# Altium schematic sheet Pasa_altas.SchDoc
size A; SheetNumber: 2; SheetTotal: 4
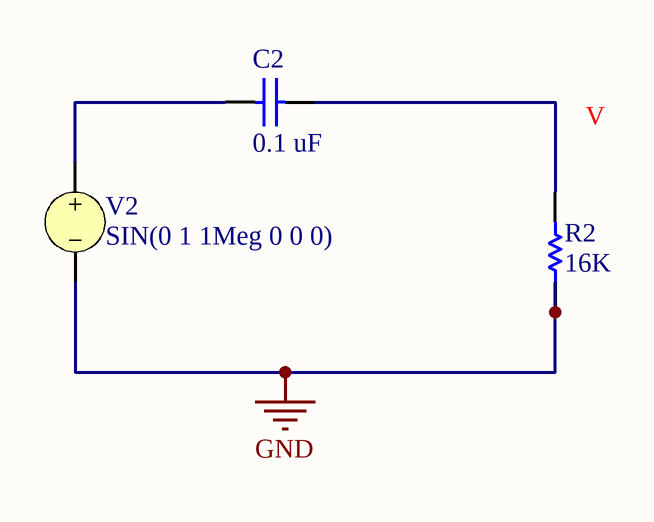
[diagram p0: Pasa_altas.SchDoc]

## Parts
C2  value 0.1 uF  (hidden comment: Capacitor)
R2  value 16K  (hidden comment: Resistor)
V2  SIN(0 1 1Meg 0 0 0)

## Nets
GND: R2.1 V2.2
NetC2_1: C2.1 V2.1
NetC2_2: C2.2 R2.2

## Library data of the parts
C2 = Capacitor: SimulationGenericComponent: True
R2 = Resistor: TC1: 0; SimulationGenericComponent: True; TC2: 0
V2 = VSRC: Voltage Source; Note: PCB Footprint - Not required; AC Magnitude: 1; AC Phase: 0; Published: 8-Jun-2000; LatestRevisionDate: 17-Jul-2002; LatestRevisionNote: Re-released for DXP Platform.; PackageReference: Not Applicable; Publisher: Altium Limited; DC Magnitude: 1; Offset: 0; Amplitude: 1; Frequency: 1Meg; Delay: 0; Damping Factor: 0; Phase: 0